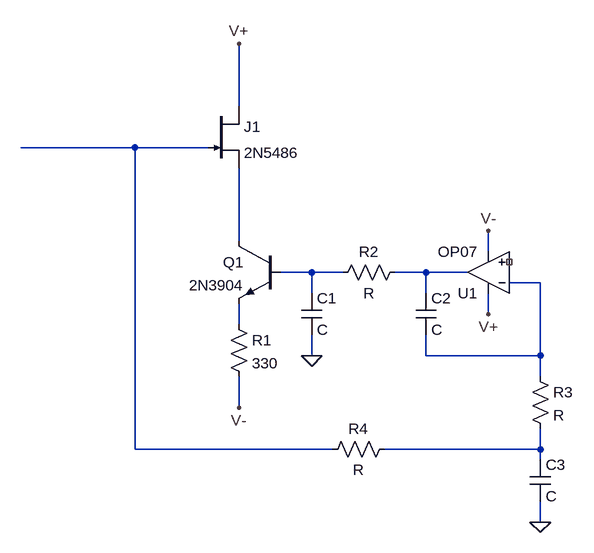
[diagram p0: schematic Draft1.asc]
Draft1.asc, the LTspice schematic file:
Version 4
SHEET 1 880 740
WIRE 160 80 160 -16
WIRE 0 144 -176 144
WIRE 112 144 0 144
WIRE 160 288 160 176
WIRE 544 304 544 272
WIRE 272 336 224 336
WIRE 320 336 272 336
WIRE 448 336 400 336
WIRE 512 336 448 336
WIRE 624 352 576 352
WIRE 272 368 272 336
WIRE 448 368 448 336
WIRE 544 400 544 368
WIRE 160 416 160 384
WIRE 272 464 272 432
WIRE 448 464 448 432
WIRE 624 464 624 352
WIRE 624 464 448 464
WIRE 624 496 624 464
WIRE 160 544 160 496
WIRE 0 608 0 144
WIRE 304 608 0 608
WIRE 624 608 624 576
WIRE 624 608 384 608
WIRE 624 624 624 608
WIRE 624 720 624 688
FLAG 160 -16 V+
FLAG 160 544 V-
FLAG 544 272 V-
FLAG 544 400 V+
FLAG 272 464 0
FLAG 624 720 0
SYMBOL njf 112 80 R0
SYMATTR InstName J1
SYMATTR Value 2N5486
SYMBOL npn 224 288 M0
SYMATTR InstName Q1
SYMATTR Value 2N3904
SYMBOL res 144 400 R0
SYMATTR InstName R1
SYMATTR Value 330
SYMBOL Opamps\\OP07 544 400 R180
SYMATTR InstName U1
SYMBOL res 416 320 R90
WINDOW 0 0 56 VBottom 2
WINDOW 3 32 56 VTop 2
SYMATTR InstName R2
SYMBOL cap 256 368 R0
SYMATTR InstName C1
SYMBOL cap 432 368 R0
SYMATTR InstName C2
SYMBOL res 608 480 R0
SYMATTR InstName R3
SYMBOL cap 608 624 R0
SYMATTR InstName C3
SYMBOL res 400 592 R90
WINDOW 0 0 56 VBottom 2
WINDOW 3 32 56 VTop 2
SYMATTR InstName R4

The netlist it stands for:
* Draft1.asc
J1 V+ N001 N002 2N5486
Q1 N002 N003 N006 0 2N3904
R1 N006 V- 330
XU1 NC_01 N005 V+ V- N004 LT1001  ; OP07, pins In+ In- V+ V- OUT
R2 N004 N003 R
C1 N003 0 C
C2 N004 N005 C
R3 N005 N007 R
C3 N007 0 C
R4 N007 N001 R
.model NPN NPN
.model PNP PNP
.lib standard.bjt
.model NJF NJF
.model PJF PJF
.lib standard.jft
.lib LTC.lib
.backanno
.end